# Altium schematic sheet Sheet1_popravljena.SchDoc: Merilnik hitrosti
size A4; Author: Mitja Alic; DocumentNumber: 1; DocumentName: Microcontroler
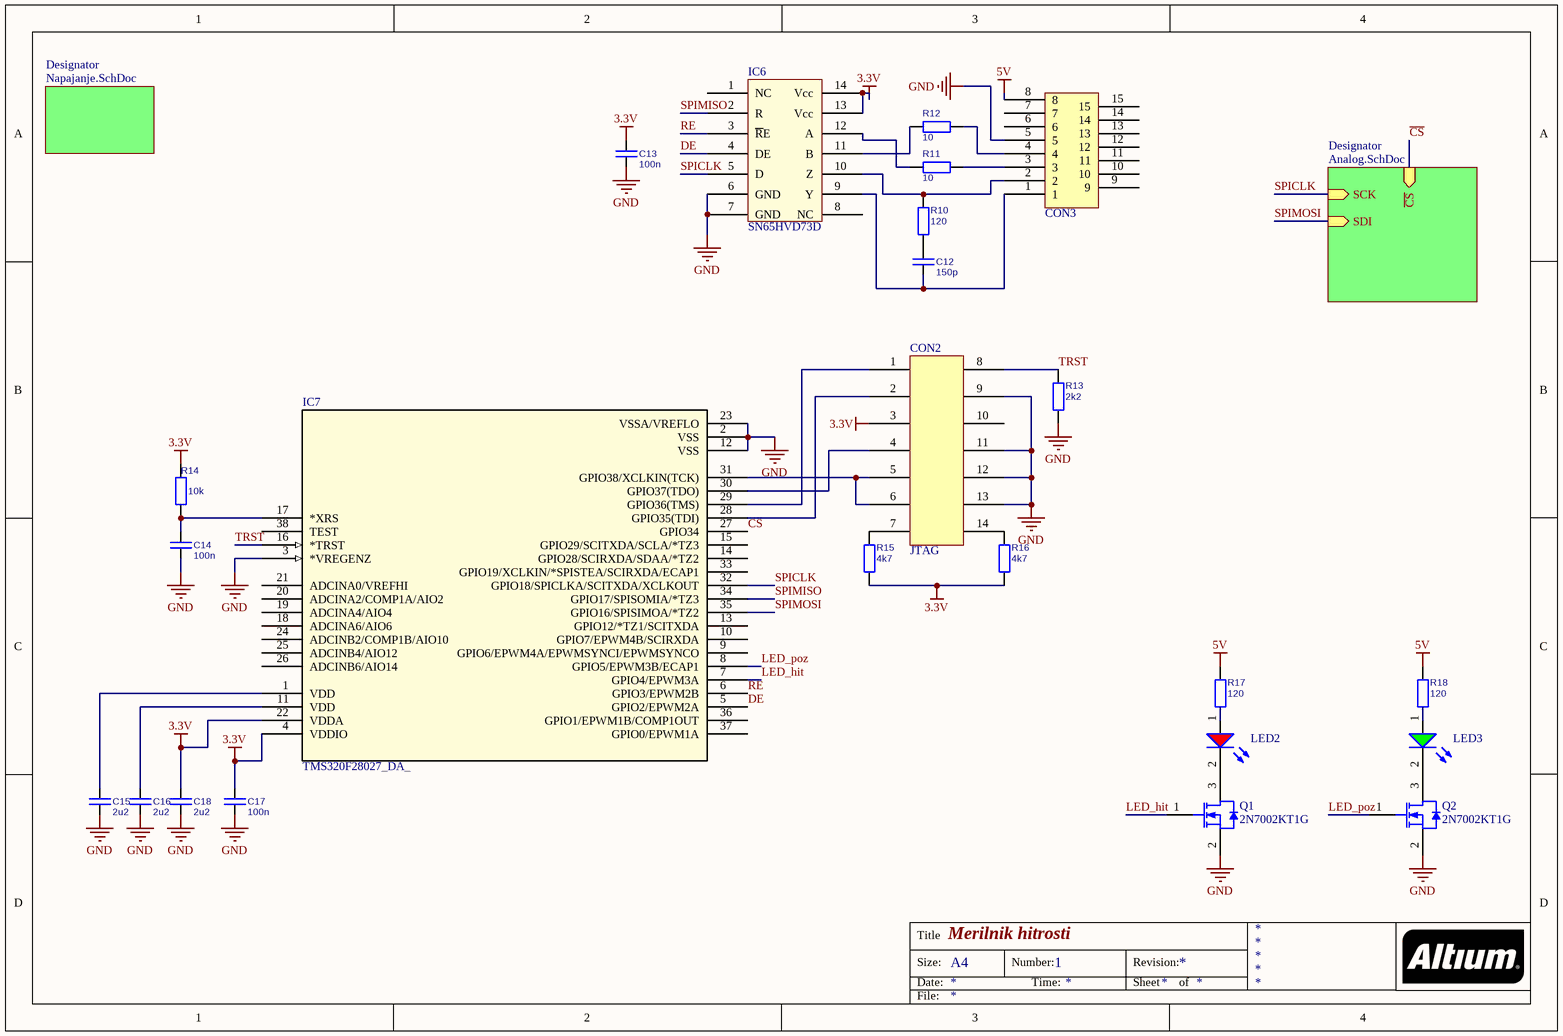
[diagram p0: Sheet1_popravljena.SchDoc]

## Parts
C12  150p  [C0603]
C13  100n  [C0603]
C14  100n  [C0603]
C15  2u2  [C0603]
C16  2u2  [C0603]
C17  100n  [C0603]
C18  2u2  [C0603]
CON2  JTAG  [JTAG micromatch]
CON3  DSUbConector  [DSUB conector]  (value not drawn)
IC6  SN65HVD73D
IC7  TMS320F28027_DA_  [TSOP65P810X120-38N]
LED2  150060RS75000  [LED_0603_Red]  (value not drawn)
LED3  150060VS75000  [LED_0603_Bright Green]  (value not drawn)
Q1  2N7002KT1G  [NXP-SOT23_N]
Q2  2N7002KT1G  [NXP-SOT23_N]
R10  120  [R0603]
R11  10  [R0603]
R12  10  [R0603]
R13  value 2k2  [R0805]  (hidden comment: 120)
R14  value 10k  [R0805]  (hidden comment: 120)
R15  4k7  [R0805]
R16  4k7  [R0805]
R17  120  [R0805]
R18  120  [R0805]

## Sub-sheets
Designator = Napajanje.SchDoc: no entries
Designator = Analog.SchDoc: SCK (in), SDI (in), ~{CS} (in)

## Nets
3.3V: C13.1 C17.1 C18.1 CON2.3 IC6.13(Vcc) IC6.14(Vcc) IC7.4(VDDIO) IC7.22(VDDA) R14.1 R15.1 R16.1
5V: CON3.8 R17.1 R18.1
GND: C13.2 C14.2 C15.2 C16.2 C17.2 C18.2 CON2.9 CON2.11 CON2.12 CON2.13 CON3.5 IC6.6(GND) IC6.7(GND) IC7.2(VSS) IC7.3(*VREGENZ) IC7.12(VSS) IC7.23(VSSA/VREFLO) Q1.2(S) Q2.2(S) R13.1
~{CS}: IC7.27(GPIO34) ; sheet Designator/~{CS}
DE: IC6.4(DE) IC7.5(GPIO2/EPWM2A)
LED_hit: IC7.7(GPIO4/EPWM3A) Q1.1(G)
LED_poz: IC7.8(GPIO5/EPWM3B/ECAP1) Q2.1(G)
RE: IC6.3(~{R}E) IC7.6(GPIO3/EPWM2B)
SPICLK: IC6.5(D) IC7.32(GPIO18/SPICLKA/SCITXDA/XCLKOUT) ; sheet Designator/SCK
SPIMISO: IC6.2(R) IC7.34(GPIO17/SPISOMIA/*TZ3)
SPIMOSI: IC7.35(GPIO16/SPISIMOA/*TZ2) ; sheet Designator/SDI
TRST: CON2.8 IC7.16(*TRST) R13.2
NetC12_1: C12.1 R10.2
NetC12_2: C12.2 CON3.1 IC6.9(Y)
NetC14_1: C14.1 IC7.17(*XRS) R14.2
NetC15_1: C15.1 IC7.1(VDD)
NetC16_1: C16.1 IC7.11(VDD)
NetCON2_1: CON2.1 IC7.29(GPIO36(TMS))
NetCON2_2: CON2.2 IC7.28(GPIO35(TDI))
NetCON2_4: CON2.4 IC7.30(GPIO37(TDO))
NetCON2_5: CON2.5 CON2.6 IC7.31(GPIO38/XCLKIN(TCK))
NetCON2_7: CON2.7 R15.2
NetCON2_14: CON2.14 R16.2
NetCON3_2: CON3.2 IC6.10(Z) R10.1
NetCON3_3: CON3.3 R11.1
NetCON3_4: CON3.4 R12.1
NetIC6_11: IC6.11(B) R12.2
NetIC6_12: IC6.12(A) R11.2
NetLED2_1: LED2.1(A) R17.2
NetLED2_2: LED2.2(C) Q1.3(D)
NetLED3_1: LED3.1(A) R18.2
NetLED3_2: LED3.2(C) Q2.3(D)

Not connected (* = marked no-connect by the designer): CON2 10; CON3 6 7 9 10 11 12 13 14 15; IC6 1(NC) 8(NC); IC7 9(GPIO6/EPWM4A/EPWMSYNCI/EPWMSYNCO) 10(GPIO7/EPWM4B/SCIRXDA) 13(GPIO12/*TZ1/SCITXDA) 14(GPIO28/SCIRXDA/SDAA/*TZ2) 15(GPIO29/SCITXDA/SCLA/*TZ3) 18(ADCINA6/AIO6) 19(ADCINA4/AIO4) 20(ADCINA2/COMP1A/AIO2) 21(ADCINA0/VREFHI) 24(ADCINB2/COMP1B/AIO10) 25(ADCINB4/AIO12) 26(ADCINB6/AIO14) 33(GPIO19/XCLKIN/*SPISTEA/SCIRXDA/ECAP1) 36(GPIO1/EPWM1B/COMP1OUT) 37(GPIO0/EPWM1A) 38(TEST)

## Notes on the sheet
- Title
- Size:
- Date:
- A4
- Number:
- Time:
- Revision:
- Sheet
- of
- File:

## Library data of the parts
C12-C18 = C: Capacitor
  C12: Value: 150p
  C13 C14 C17: Value: 100n
  C15 C16 C18: Value: 2u2
IC7 = TMS320F28027_DA_: Imported; Manufacturer_Part_Number: tms320f28027_da_38; Vendor: Texas Instruments; RefDes: RefDes; Type: DEV; Value: Value; Supplier 1: Farnell; Supplier Part Number 1: 2076786
LED2 = WL-SMCW 0603  150060RS75000: SMD mono-color Chip LED, WL-SMCW, Red; Manufacturer: W黵th Elektronik eiSos GmbH; PartNo: 150060RS75000; ComponentLink1Description: Manufacturer; ComponentLink1URL: http://www.we-online.de; Created by: Christin Otto; Created Date: June 2013; ComponentLink2Description: Datasheet; ComponentLink2URL: http://katalog.we-online.com/led/datasheet/150060RS75000.pdf; Color: Red; Supplier 1: Farnell; Supplier Part Number 1: 2322071
LED3 = WL-SMCW 0603  150060VS75000: SMD mono-color Chip LED, WL-SMCW, Bright Green; Manufacturer: W黵th Elektronik eiSos GmbH; PartNo: 150060VS75000; ComponentLink1Description: Manufacturer; ComponentLink1URL: http://www.we-online.de; Created by: Christin Otto; Created Date: June 2013; ComponentLink2Description: Datasheet; ComponentLink2URL: http://katalog.we-online.com/led/datasheet/150060VS75000.pdf; Color: Bright Green; Supplier 1: Farnell; Supplier Part Number 1: 2322073
Q1 Q2 = BSN20,215: N-Channel Enhancement Mode Field-Effect Transistor, 50 V, 0.173 A, 3-Pin SOT23, Tape and Reel; Supplier 1: Farnell; Supplier Part Number 1: 1764535
R10-R18 = R
  R10: Value: 120
  R11 R12: Value: 10
  R14: Supplier 1: Farnell; Supplier Part Number 1: 9332596
  R15 R16: Value: 4k7
  R17 R18: Value: 120; Supplier 1: Farnell; Supplier Part Number 1: 9332596
CON2 = JTAG: Supplier Part Number 1: 148647; Supplier 1: Farnell
CON3 = DSUbConector: Supplier 1: Farnell; Supplier Part Number 1: 1099295
IC6 = SN65HVD73D: Supplier 1: Farnell; Supplier Part Number 1: 2455484